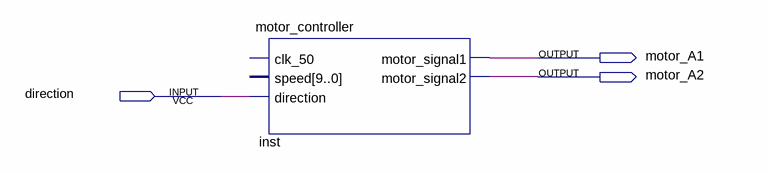
[diagram p0: schematic sheet]
// Quartus schematic block_motor_control.bdf as structural Verilog: 1 symbols, 3 pins
module block_motor_control (
  input  direction,
  output motor_A1,
  output motor_A2
);

  motor_controller inst (
    .direction(direction), .motor_signal1(motor_A1), .motor_signal2(motor_A2));  // open: clk_50, speed
endmodule
